# Altium schematic sheet battery_management.SchDoc
size A4; Organization: Badgerloop Electrical; Address1: 133 Engineering Research Building; Address2: 1500 Engineering Drive; Address3: Madison, Wi 53706
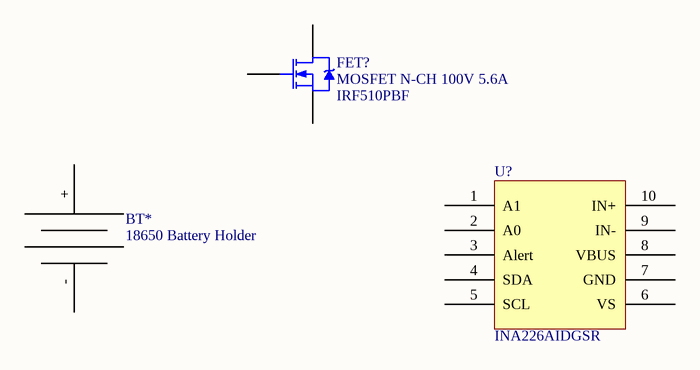
[diagram p0: battery_management.SchDoc]

## Parts
BT*  18650 Battery Holder  [KEYSTONE1042]  (mechanical)
FET?  MOSFET N-CH 100V 5.6A  Manufacturer P/N: IRF510PBF  [TO220AB]
U?  INA226AIDGSR  [TSSOP50P490X110-10N]

## Nets

Not connected (* = marked no-connect by the designer): BT* +(POS) -(NEG); FET? 1(G) 2(D) 3(S); U? 1(A1) 2(A0) 3(Alert) 4(SDA) 5(SCL) 6(VS) 7(GND) 8(VBUS) 9(IN-) 10(IN+)

## Notes on the sheet
- Title
- Engineer:
- Date:
- Revision:
- Sheet
- of
- File:

## Library data of the parts
BT* = 18650 Battery Holder: Keystone Electronics P/N1042
FET? = MOSFET N-CH 100V 5.6A: N-Channel 100V 5.6A (Tc) 43W (Tc) Through Hole TO-220AB; Manufacturer: Vishay Siliconix; Digikey P/N: IRF510PBF-ND